# Altium project PCL_P1.PrjPcb
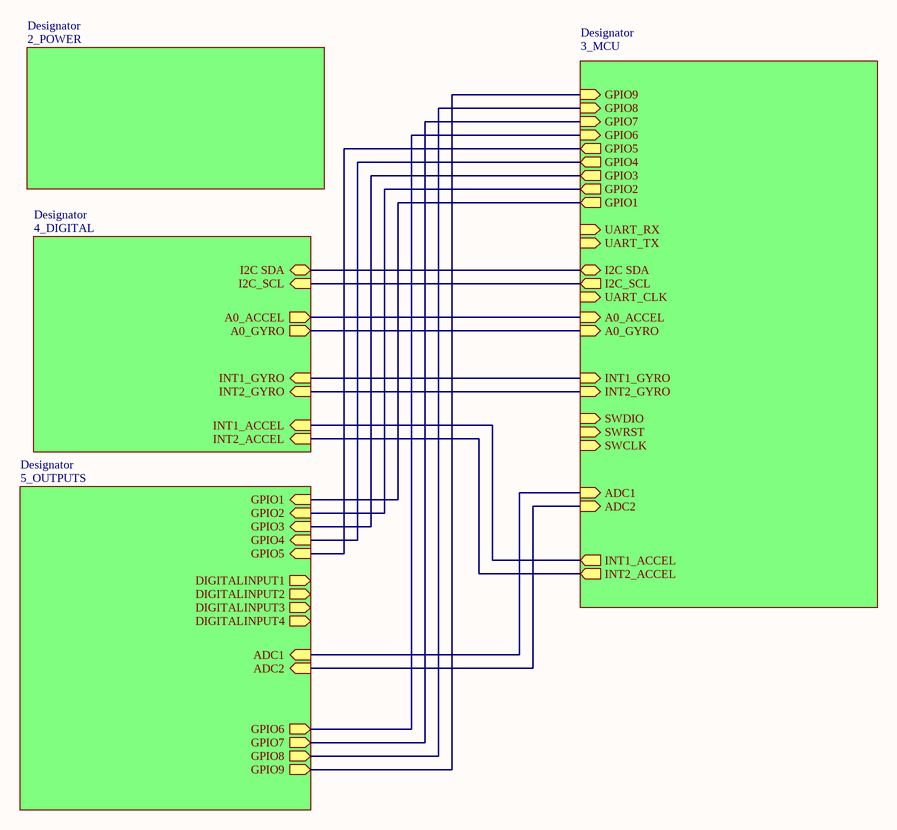
[diagram p0: 1_BLOCK.SchDoc]
5 sheets, 135 parts. Net scope: hierarchical (ports join the sheet entries above them; power ports are global).
Board file: PCB1.PcbDoc
Sheets:
  1_BLOCK.SchDoc
    Designator = 3_MCU.SchDoc
    Designator = 4_DIGITAL.SchDoc
    Designator = 5_OUTPUTS.SchDoc
    Designator = 2_POWER.SchDoc

## Sheet 1_BLOCK.SchDoc
size 420 x 297 mm; SheetNumber: 1; SheetTotal: 4

### Sub-sheets
Designator = 3_MCU: GPIO1 (out), GPIO2 (out), GPIO3 (out), GPIO4 (out), GPIO5 (out), GPIO6 (in), GPIO7 (in), GPIO8 (in), GPIO9 (in), SWDIO (in), I2C SDA (bidir), I2C_SCL (out), UART_CLK (in), A0_ACCEL (in), A0_GYRO (in), INT1_GYRO (in), INT2_GYRO (in), SWRST (in), UART_TX (in), UART_RX (in), ADC1 (in), ADC2 (in), SWCLK (in), INT1_ACCEL (out), INT2_ACCEL (out)
Designator = 4_DIGITAL: I2C_SCL (in), A0_ACCEL (out), A0_GYRO (out), INT1_GYRO (in), INT2_GYRO (in), I2C SDA (bidir), INT1_ACCEL (in), INT2_ACCEL (in)
Designator = 5_OUTPUTS: GPIO1 (in), GPIO2 (in), GPIO3 (in), GPIO4 (in), GPIO5 (in), GPIO6 (out), GPIO7 (out), GPIO8 (out), GPIO9 (out), DIGITALINPUT1 (out), DIGITALINPUT2 (out), DIGITALINPUT3 (out), DIGITALINPUT4 (out), ADC1 (in), ADC2 (in)
Designator = 2_POWER: no entries

### Nets
A0_ACCEL: sheet Designator/A0_ACCEL, sheet Designator/A0_ACCEL
A0_GYRO: sheet Designator/A0_GYRO, sheet Designator/A0_GYRO
ADC1: sheet Designator/ADC1, sheet Designator/ADC1
ADC2: sheet Designator/ADC2, sheet Designator/ADC2
GPIO1: sheet Designator/GPIO1, sheet Designator/GPIO1
GPIO2: sheet Designator/GPIO2, sheet Designator/GPIO2
GPIO3: sheet Designator/GPIO3, sheet Designator/GPIO3
GPIO4: sheet Designator/GPIO4, sheet Designator/GPIO4
GPIO5: sheet Designator/GPIO5, sheet Designator/GPIO5
GPIO6: sheet Designator/GPIO6, sheet Designator/GPIO6
GPIO7: sheet Designator/GPIO7, sheet Designator/GPIO7
GPIO8: sheet Designator/GPIO8, sheet Designator/GPIO8
GPIO9: sheet Designator/GPIO9, sheet Designator/GPIO9
I2C_SCL: sheet Designator/I2C_SCL, sheet Designator/I2C_SCL
I2C_SDA: sheet Designator/I2C SDA, sheet Designator/I2C SDA
INT1_ACCEL: sheet Designator/INT1_ACCEL, sheet Designator/INT1_ACCEL
INT1_GYRO: sheet Designator/INT1_GYRO, sheet Designator/INT1_GYRO
INT2_ACCEL: sheet Designator/INT2_ACCEL, sheet Designator/INT2_ACCEL
INT2_GYRO: sheet Designator/INT2_GYRO, sheet Designator/INT2_GYRO

### Notes on the sheet
- THIS DOCUMENT AND THE DATA DISCLOSED HEREIN OR
- HEREWITH IS THE PROPERTY OF ALTIUM LIMITED AND MAY
- DWG NO:
- REVISION
- REV:
- DESCRIPTION
- DATE
- APPROVED
- BE FREELY DISTRIBUTED IN WHOLE. NO RIGHTS ARE
- RESERVED OR EXPRESS OR IMPLIED WARANTEE GIVEN.
- ENG:
- APPROVALS
- PROJECT
- DSN:
- CHK:
- REFERENCE DOCUMENTS
- PROJECT REVISION:
- TITLE
- DOCUMENT REVISION:
- DESIGN ITEM:
- BOM:
- FAB DWG:
- PCB DWG:
- ASSY DWG:
- SCALE:
- A3
- SIZE
- CAGE CODE
- FILE NAME
- DWG NO.
- SHEET
- OF
- REV

## Sheet 3_MCU.SchDoc
size 420 x 297 mm; SheetNumber: 3; SheetTotal: 5
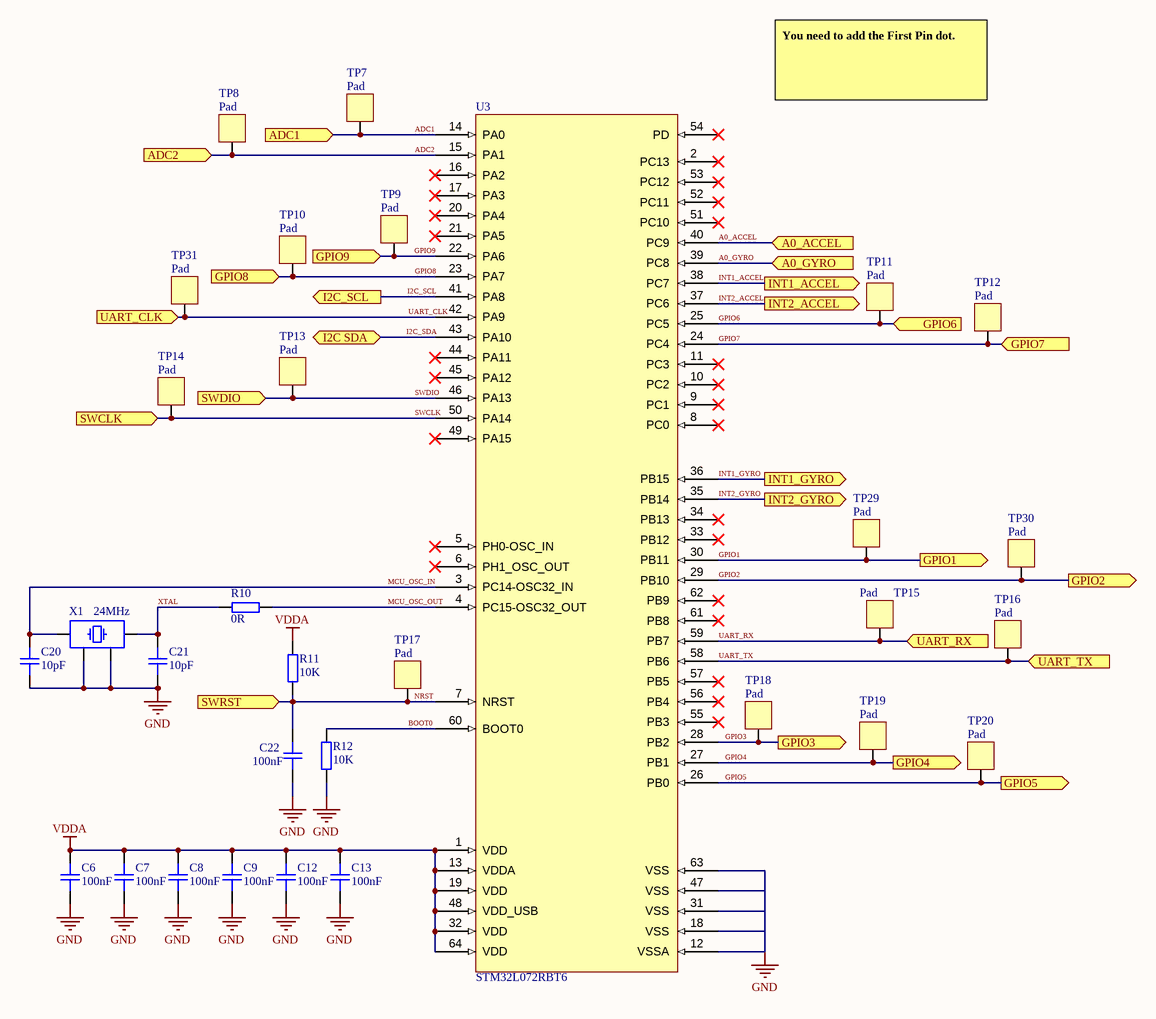
[diagram p1: 3_MCU.SchDoc]

### Parts
C6  100nF  [CAP_0603]
C7  100nF  [CAP_0603]
C8  100nF  [CAP_0603]
C9  100nF  [CAP_0603]
C12  100nF  [CAP_0603]
C13  100nF  [CAP_0603]
C20  10pF  [CAP_0402]
C21  10pF  [CAP_0402]
C22  100nF  [CAP_0603]
R10  0R  [RES_0603]
R11  10K  [RES_0603]
R12  10K  [RES_0603]
TP7  Pad  [PAD_SQ_2MM]  (no BOM)
TP8  Pad  [PAD_SQ_2MM]  (no BOM)
TP9  Pad  [PAD_SQ_2MM]  (no BOM)
TP10  Pad  [PAD_SQ_2MM]  (no BOM)
TP11  Pad  [PAD_SQ_2MM]  (no BOM)
TP12  Pad  [PAD_SQ_2MM]  (no BOM)
TP13  Pad  [PAD_SQ_2MM]  (no BOM)
TP14  Pad  [PAD_SQ_2MM]  (no BOM)
TP15  Pad  [PAD_SQ_2MM]  (no BOM)
TP16  Pad  [PAD_SQ_2MM]  (no BOM)
TP17  Pad  [PAD_SQ_2MM]  (no BOM)
TP18  Pad  [PAD_SQ_2MM]  (no BOM)
TP19  Pad  [PAD_SQ_2MM]  (no BOM)
TP20  Pad  [PAD_SQ_2MM]  (no BOM)
TP29  Pad  [PAD_SQ_2MM]  (no BOM)
TP30  Pad  [PAD_SQ_2MM]  (no BOM)
TP31  Pad  [PAD_SQ_2MM]  (no BOM)
U3  STM32L072RBT6  [LQFP64 - 64-pin]
X1  24MHz  [XTAL_2520]

### Ports
A0_ACCEL (in, see 1_BLOCK[3C], 4_DIGITAL[1C]), A0_GYRO (in, see 1_BLOCK[3C], 4_DIGITAL[1C]), ADC1 (in, see 1_BLOCK[3C], 5_OUTPUTS[1D]), ADC2 (in, see 1_BLOCK[3C], 5_OUTPUTS[2D]), GPIO1 (out, see 1_BLOCK[3B], 5_OUTPUTS[1B]), GPIO2 (out, see 1_BLOCK[3B], 5_OUTPUTS[1B]), GPIO3 (out, see 1_BLOCK[3B], 5_OUTPUTS[1B]), GPIO4 (out, see 1_BLOCK[3B], 5_OUTPUTS[2B]), GPIO5 (out, see 1_BLOCK[3B], 5_OUTPUTS[2B]), GPIO6 (in, see 1_BLOCK[3B], 5_OUTPUTS[2C]), GPIO7 (in, see 1_BLOCK[3B], 5_OUTPUTS[2C]), GPIO8 (in, see 1_BLOCK[3B], 5_OUTPUTS[2C]), GPIO9 (in, see 1_BLOCK[3B], 5_OUTPUTS[2C]), I2C SDA (bidir, see 1_BLOCK[3C], 4_DIGITAL[2C]), I2C_SCL (out, see 1_BLOCK[3C], 4_DIGITAL[2C]), INT1_ACCEL (out, see 1_BLOCK[3C], 4_DIGITAL[3C]), INT1_GYRO (out, see 1_BLOCK[3C], 4_DIGITAL[4C]), INT2_ACCEL (out, see 1_BLOCK[3C], 4_DIGITAL[0C], 4_DIGITAL[3C]), INT2_GYRO (out, see 1_BLOCK[3C], 4_DIGITAL[4C]), SWCLK (in, see 1_BLOCK[3C]), SWDIO (in, see 1_BLOCK[3C]), SWRST (in, see 1_BLOCK[3C]), UART_CLK (in, see 1_BLOCK[3C]), UART_RX (in, see 1_BLOCK[3C]), UART_TX (in, see 1_BLOCK[3C])

### Nets
GND: C6.1 C7.1 C8.1 C9.1 C12.1 C13.1 C20.1 C21.1 C22.1 R12.1 U3.12(VSSA) U3.18(VSS) U3.31(VSS) U3.47(VSS) U3.63(VSS) X1.2 X1.4
VDDA: C6.2 C7.2 C8.2 C9.2 C12.2 C13.2 R11.2 U3.1(VDD) U3.13(VDDA) U3.19(VDD) U3.32(VDD) U3.48(VDD_USB) U3.64(VDD)  [project net 3V]
A0_ACCEL: U3.40(PC9) ; port A0_ACCEL
A0_GYRO: U3.39(PC8) ; port A0_GYRO
ADC1: TP7.1 U3.14(PA0) ; port ADC1
ADC2: TP8.1 U3.15(PA1) ; port ADC2
BOOT0: R12.2 U3.60(BOOT0)
GPIO1: TP29.1 U3.30(PB11) ; port GPIO1
GPIO2: TP30.1 U3.29(PB10) ; port GPIO2
GPIO3: TP18.1 U3.28(PB2) ; port GPIO3
GPIO4: TP19.1 U3.27(PB1) ; port GPIO4
GPIO5: TP20.1 U3.26(PB0) ; port GPIO5
GPIO6: TP11.1 U3.25(PC5) ; port GPIO6
GPIO7: TP12.1 U3.24(PC4) ; port GPIO7
GPIO8: TP10.1 U3.23(PA7) ; port GPIO8
GPIO9: TP9.1 U3.22(PA6) ; port GPIO9
I2C_SCL: U3.41(PA8) ; port I2C_SCL
I2C_SDA: U3.43(PA10) ; port I2C SDA
INT1_ACCEL: U3.38(PC7) ; port INT1_ACCEL
INT1_GYRO: U3.36(PB15) ; port INT1_GYRO
INT2_ACCEL: U3.37(PC6) ; port INT2_ACCEL
INT2_GYRO: U3.35(PB14) ; port INT2_GYRO
MCU_OSC_IN: C20.2 U3.3(PC14-OSC32_IN) X1.1
MCU_OSC_OUT: R10.2 U3.4(PC15-OSC32_OUT)
NRST: C22.2 R11.1 TP17.1 U3.7(NRST) ; port SWRST
SWCLK: TP14.1 U3.50(PA14) ; port SWCLK
SWDIO: TP13.1 U3.46(PA13) ; port SWDIO
UART_CLK: TP31.1 U3.42(PA9) ; port UART_CLK
UART_RX: TP15.1 U3.59(PB7) ; port UART_RX
UART_TX: TP16.1 U3.58(PB6) ; port UART_TX
XTAL: C21.2 R10.1 X1.3

Not connected (* = marked no-connect by the designer): U3 2(PC13)* 5(PH0-OSC_IN)* 6(PH1_OSC_OUT)* 8(PC0)* 9(PC1)* 10(PC2)* 11(PC3)* 16(PA2)* 17(PA3)* 20(PA4)* 21(PA5)* 33(PB12)* 34(PB13)* 44(PA11)* 45(PA12)* 49(PA15)* 51(PC10)* 52(PC11)* 53(PC12)* 54(PD)* 55(PB3)* 56(PB4)* 57(PB5)* 61(PB8)* 62(PB9)*

### Notes on the sheet
- You need to add the First Pin dot.
- THIS DOCUMENT AND THE DATA DISCLOSED HEREIN OR
- HEREWITH IS THE PROPERTY OF ALTIUM LIMITED AND MAY
- DWG NO:
- REVISION
- REV:
- DESCRIPTION
- DATE
- APPROVED
- BE FREELY DISTRIBUTED IN WHOLE. NO RIGHTS ARE
- RESERVED OR EXPRESS OR IMPLIED WARANTEE GIVEN.
- ENG:
- APPROVALS
- PROJECT
- DSN:
- CHK:
- REFERENCE DOCUMENTS
- PROJECT REVISION:
- TITLE
- DOCUMENT REVISION:
- DESIGN ITEM:
- BOM:
- FAB DWG:
- PCB DWG:
- ASSY DWG:
- SCALE:
- A3
- SIZE
- CAGE CODE
- FILE NAME
- DWG NO.
- SHEET
- OF
- REV

### Library data of the parts
C6-C9 C12 C13 C22 = CAP_0603_16V: Capacitor SMD 0603 16V
C20 C21 = CAP_0402_16V: Capacitor SMD 0402 16V
R10-R12 = RES_0603: Resistor SMD 0603; Manufacturer: *; Manufacturer Part Number: *; Distributor Link: *
TP7-TP20 TP29-TP31 = PAD_SQ_2MM: Test Point Square 2mm
U3 = STM32L072RBT6: 128KB 1.8V~3.6V ARM-MSeries 20KB 32MHz FLASH 51 LQFP-64(10x10) Microcontroller Units (MCUs/MPUs/SOCs) ROHS
X1 = XTAL_2520: Crystal SMD 2520; Distributor Link: *

## Sheet 4_DIGITAL.SchDoc
size 420 x 297 mm; SheetNumber: 4; SheetTotal: 5
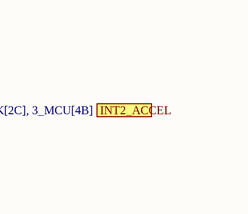
[diagram p2: 4_DIGITAL.SchDoc, left]
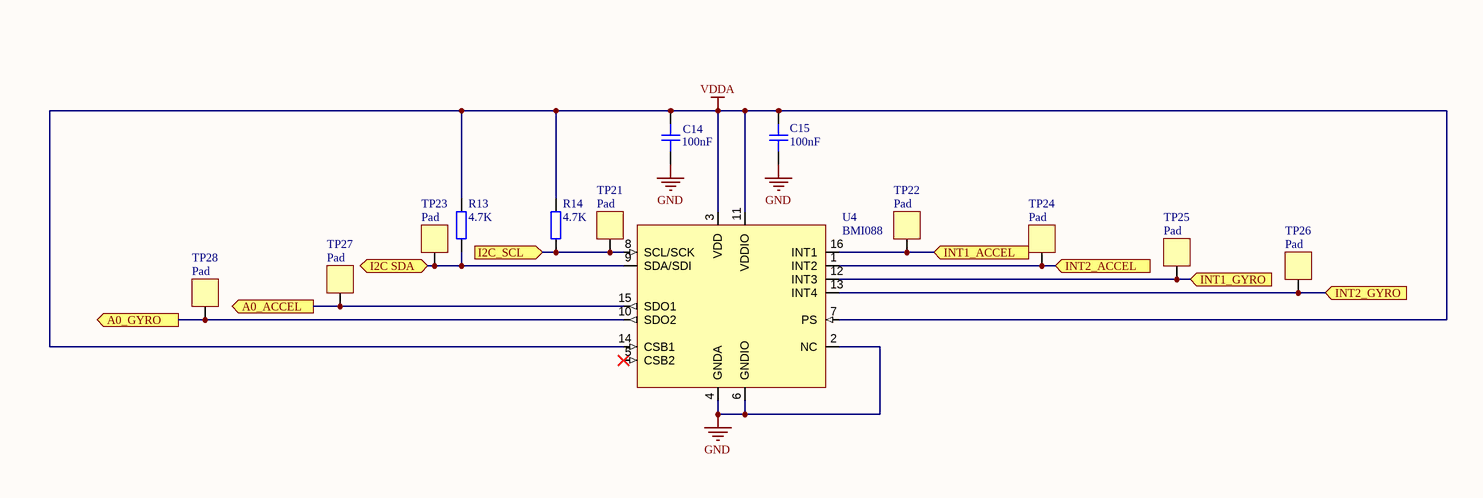
[diagram p3: 4_DIGITAL.SchDoc, right]

### Parts
C14  100nF  [CAP_0603]
C15  100nF  [CAP_0603]
R13  4.7K  [RES_0603]
R14  4.7K  [RES_0603]
TP21  Pad  [PAD_SQ_2MM]  (no BOM)
TP22  Pad  [PAD_SQ_2MM]  (no BOM)
TP23  Pad  [PAD_SQ_2MM]  (no BOM)
TP24  Pad  [PAD_SQ_2MM]  (no BOM)
TP25  Pad  [PAD_SQ_2MM]  (no BOM)
TP26  Pad  [PAD_SQ_2MM]  (no BOM)
TP27  Pad  [PAD_SQ_2MM]  (no BOM)
TP28  Pad  [PAD_SQ_2MM]  (no BOM)
U4  BMI088  [BMI088]

### Ports
A0_ACCEL (out, see 1_BLOCK[2C], 3_MCU[4B]), A0_GYRO (out, see 1_BLOCK[2C], 3_MCU[4B]), I2C SDA (bidir, see 1_BLOCK[2C], 3_MCU[3B]), I2C_SCL (in, see 1_BLOCK[2C], 3_MCU[3B]), INT1_ACCEL (in, see 1_BLOCK[2C], 3_MCU[4B]), INT1_GYRO (in, see 1_BLOCK[2C], 3_MCU[4B]), INT2_ACCEL (in, see 1_BLOCK[2C], 3_MCU[4B]), INT2_ACCEL (see 1_BLOCK[2C], 3_MCU[4B]), INT2_GYRO (in, see 1_BLOCK[2C], 3_MCU[4B])

### Nets
GND: C14.1 C15.1 U4.2(NC) U4.4(GNDA) U4.6(GNDIO)
VDDA: C14.2 C15.2 R13.2 R14.2 U4.3(VDD) U4.7(PS) U4.11(VDDIO) U4.14(CSB1)  [project net 3V]
A0_ACCEL: TP27.1 U4.15(SDO1) ; port A0_ACCEL
A0_GYRO: TP28.1 U4.10(SDO2) ; port A0_GYRO
I2C_SCL: R14.1 TP21.1 U4.8(SCL/SCK) ; port I2C_SCL
I2C_SDA: R13.1 TP23.1 U4.9(SDA/SDI) ; port I2C SDA
INT1_ACCEL: TP22.1 U4.16(INT1) ; port INT1_ACCEL
INT1_GYRO: TP25.1 U4.12(INT3) ; port INT1_GYRO
INT2_ACCEL: TP24.1 U4.1(INT2) ; port INT2_ACCEL
INT2_GYRO: TP26.1 U4.13(INT4) ; port INT2_GYRO

Not connected (* = marked no-connect by the designer): U4 5(CSB2)*

### Notes on the sheet
- THIS DOCUMENT AND THE DATA DISCLOSED HEREIN OR
- HEREWITH IS THE PROPERTY OF ALTIUM LIMITED AND MAY
- DWG NO:
- REVISION
- REV:
- DESCRIPTION
- DATE
- APPROVED
- BE FREELY DISTRIBUTED IN WHOLE. NO RIGHTS ARE
- RESERVED OR EXPRESS OR IMPLIED WARANTEE GIVEN.
- ENG:
- APPROVALS
- PROJECT
- DSN:
- CHK:
- REFERENCE DOCUMENTS
- PROJECT REVISION:
- TITLE
- DOCUMENT REVISION:
- DESIGN ITEM:
- BOM:
- FAB DWG:
- PCB DWG:
- ASSY DWG:
- SCALE:
- A3
- SIZE
- CAGE CODE
- FILE NAME
- DWG NO.
- SHEET
- OF
- REV

### Library data of the parts
C14 C15 = CAP_0603_16V: Capacitor SMD 0603 16V
R13 R14 = RES_0603: Resistor SMD 0603; Manufacturer: *; Manufacturer Part Number: *; Distributor Link: *
TP21-TP28 = PAD_SQ_2MM: Test Point Square 2mm
U4 = BMI088: Inertial Measurement Unit IMU 6-Axis LGA; Manufacturer: Bosch; Manufacturer Part Number: BMI088

## Sheet 5_OUTPUTS.SchDoc
size 420 x 297 mm; SheetNumber: 5; SheetTotal: 5
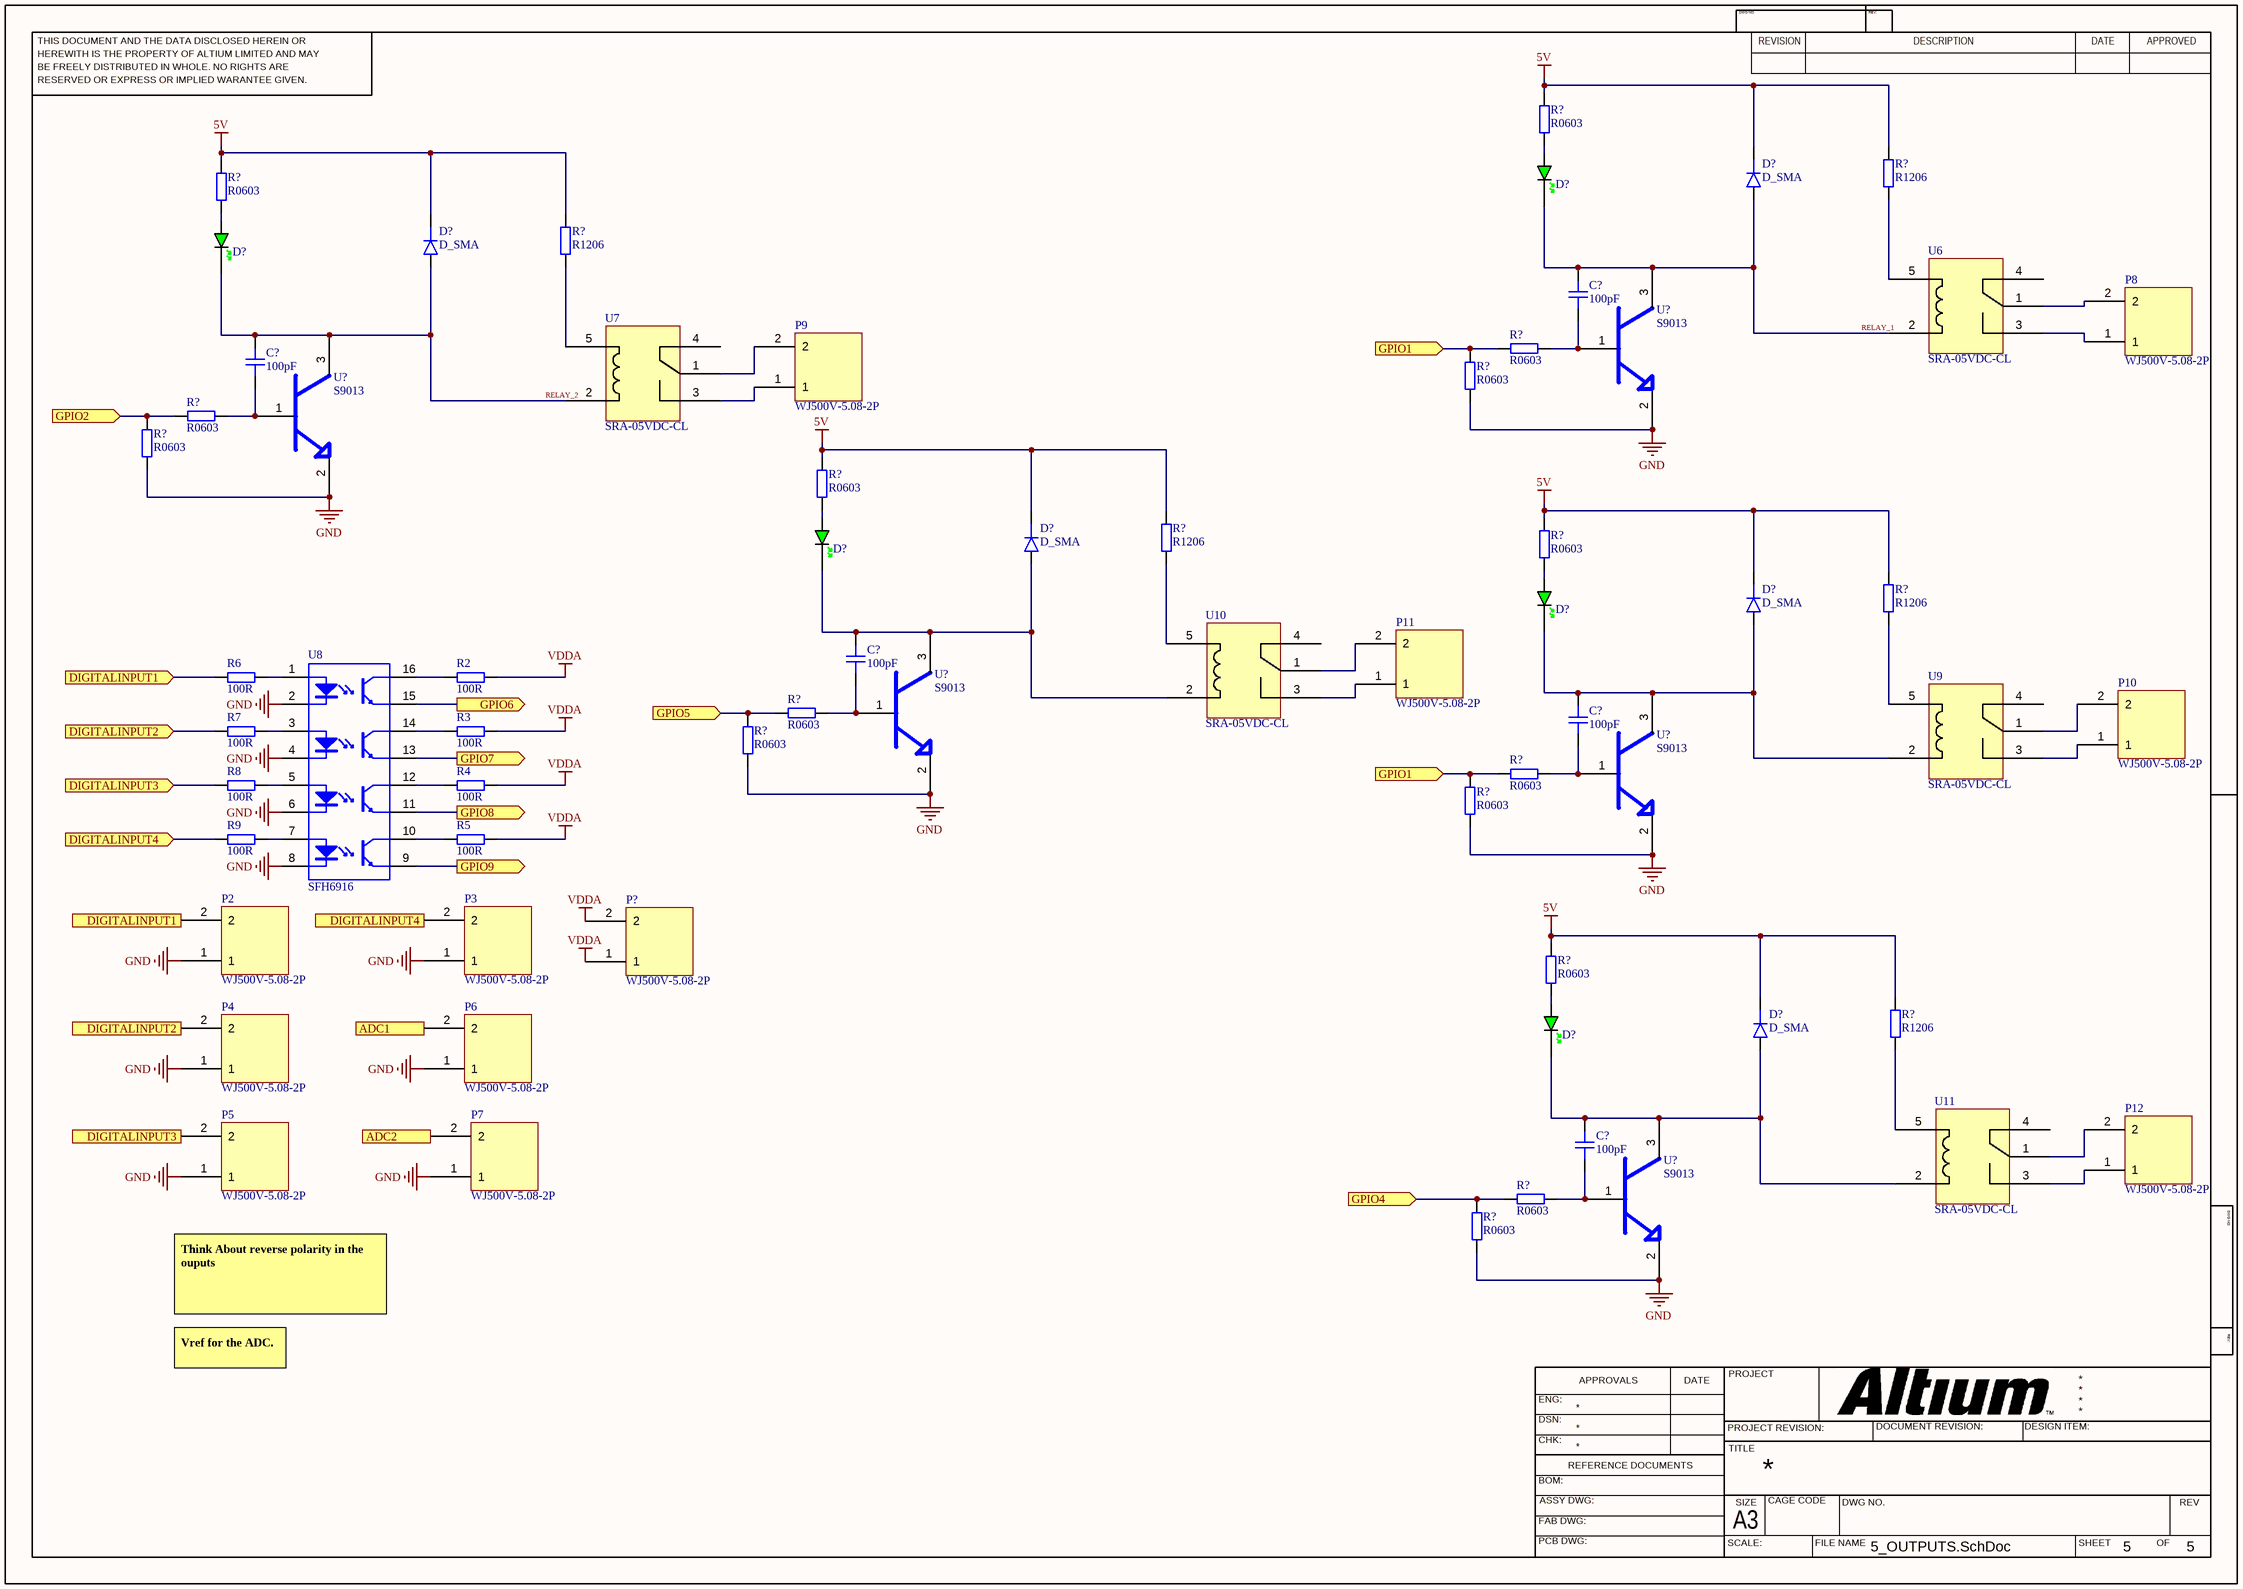
[diagram p4: 5_OUTPUTS.SchDoc]

### Parts
(Parts that share a designator on the sheet are numbered #1, #2 ... from top to bottom, then left to right.)
C?#1  100pF  [CAP_0603]
C?#2  100pF  [CAP_0603]
C?#3  100pF  [CAP_0603]
C?#4  100pF  [CAP_0603]
C?#5  100pF  [CAP_0603]
D?#1  D_SMA  [DO-214AC-2 (SMA)]
D?#2  GREEN  [LED_0603_GREEN]  (value not drawn)
D?#3  D_SMA  [DO-214AC-2 (SMA)]
D?#4  GREEN  [LED_0603_GREEN]  (value not drawn)
D?#5  D_SMA  [DO-214AC-2 (SMA)]
D?#6  GREEN  [LED_0603_GREEN]  (value not drawn)
D?#7  D_SMA  [DO-214AC-2 (SMA)]
D?#8  GREEN  [LED_0603_GREEN]  (value not drawn)
D?#9  D_SMA  [DO-214AC-2 (SMA)]
D?#10  GREEN  [LED_0603_GREEN]  (value not drawn)
P2  WJ500V-5.08-2P  [WJ500V-5.08-2P]
P3  WJ500V-5.08-2P  [WJ500V-5.08-2P]
P4  WJ500V-5.08-2P  [WJ500V-5.08-2P]
P5  WJ500V-5.08-2P  [WJ500V-5.08-2P]
P6  WJ500V-5.08-2P  [WJ500V-5.08-2P]
P7  WJ500V-5.08-2P  [WJ500V-5.08-2P]
P8  WJ500V-5.08-2P  [WJ500V-5.08-2P]
P9  WJ500V-5.08-2P  [WJ500V-5.08-2P]
P10  WJ500V-5.08-2P  [WJ500V-5.08-2P]
P11  WJ500V-5.08-2P  [WJ500V-5.08-2P]
P12  WJ500V-5.08-2P  [WJ500V-5.08-2P]
P?  WJ500V-5.08-2P  [WJ500V-5.08-2P]
R2  100R  [RES_0603]
R3  100R  [RES_0603]
R4  100R  [RES_0603]
R5  100R  [RES_0603]
R6  100R  [RES_0603]
R7  100R  [RES_0603]
R8  100R  [RES_0603]
R9  100R  [RES_0603]
R?#1  R0603  [RES_0603]
R?#2  R1206  [RES_1206]
R?#3  R0603  [RES_0603]
R?#4  R1206  [RES_1206]
R?#5  R0603  [RES_0603]
R?#6  R0603  [RES_0603]
R?#7  R0603  [RES_0603]
R?#8  R0603  [RES_0603]
R?#9  R0603  [RES_0603]
R?#10  R1206  [RES_1206]
R?#11  R0603  [RES_0603]
R?#12  R1206  [RES_1206]
R?#13  R0603  [RES_0603]
R?#14  R0603  [RES_0603]
R?#15  R0603  [RES_0603]
R?#16  R0603  [RES_0603]
R?#17  R0603  [RES_0603]
R?#18  R1206  [RES_1206]
R?#19  R0603  [RES_0603]
R?#20  R0603  [RES_0603]
U6  SRA-05VDC-CL  [SRA-05VDC-CL]
U7  SRA-05VDC-CL  [SRA-05VDC-CL]
U8  SFH6916  [VISH-SOP-16_V]
U9  SRA-05VDC-CL  [SRA-05VDC-CL]
U10  SRA-05VDC-CL  [SRA-05VDC-CL]
U11  SRA-05VDC-CL  [SRA-05VDC-CL]
U?#1  S9013  [SOT-23-3]
U?#2  S9013  [SOT-23-3]
U?#3  S9013  [SOT-23-3]
U?#4  S9013  [SOT-23-3]
U?#5  S9013  [SOT-23-3]

### Ports
ADC1 (in, see 1_BLOCK[2D], 3_MCU[3A]), ADC2 (in, see 1_BLOCK[2D], 3_MCU[2A]), DIGITALINPUT1 (in, see 1_BLOCK[2C]), DIGITALINPUT1 (out, see 1_BLOCK[2C]), DIGITALINPUT2 (in, see 1_BLOCK[2C]), DIGITALINPUT2 (out, see 1_BLOCK[2C]), DIGITALINPUT3 (in, see 1_BLOCK[2C]), DIGITALINPUT3 (out, see 1_BLOCK[2C]), DIGITALINPUT4 (in, see 1_BLOCK[2D]), DIGITALINPUT4 (out, see 1_BLOCK[2D]), GPIO1 (in, see 1_BLOCK[2C], 3_MCU[4B]), GPIO2 (in, see 1_BLOCK[2C], 3_MCU[5B]), GPIO4 (in, see 1_BLOCK[2C], 3_MCU[4C]), GPIO5 (in, see 1_BLOCK[2C], 3_MCU[5C]), GPIO6 (out, see 1_BLOCK[2D], 3_MCU[4B]), GPIO7 (out, see 1_BLOCK[2D], 3_MCU[5B]), GPIO8 (out, see 1_BLOCK[2D], 3_MCU[2B]), GPIO9 (out, see 1_BLOCK[2D], 3_MCU[3B])

### Nets
5V: D?#1.K D?#3.K D?#5.K D?#7.K D?#9.K R?#1.2 R?#2.2 R?#3.2 R?#4.2 R?#9.2 R?#10.2 R?#11.2 R?#12.2 R?#17.2 R?#18.2
GND: P2.1 P3.1 P4.1 P5.1 P6.1 P7.1 R?#6.1 R?#8.1 R?#14.1 R?#16.1 R?#20.1 U8.2(C) U8.4(C) U8.6(C) U8.8(C) U?#1.2 U?#2.2 U?#3.2 U?#4.2 U?#5.2
VDDA: P?.1 P?.2 R2.2 R3.2 R4.2 R5.2  [project net 3V]
ADC1: P6.2 ; port ADC1
ADC2: P7.2 ; port ADC2
GPIO1: R?#5.1 R?#6.2 R?#15.1 R?#16.2 ; port GPIO1
GPIO2: R?#7.1 R?#8.2 ; port GPIO2
GPIO4: R?#19.1 R?#20.2 ; port GPIO4
GPIO5: R?#13.1 R?#14.2 ; port GPIO5
GPIO6: U8.15(E) ; port GPIO6
GPIO7: U8.13(E) ; port GPIO7
GPIO8: U8.11(E) ; port GPIO8
GPIO9: U8.9(E) ; port GPIO9
RELAY_1: C?#1.1 D?#1.A D?#2.K U6.2 U?#1.3
RELAY_2: C?#2.1 D?#3.A D?#4.K U7.2 U?#2.3
NetC?#1_2: C?#1.2 R?#5.2 U?#1.1
NetC?#2_2: C?#2.2 R?#7.2 U?#2.1
NetC?#3_1: C?#3.1 D?#5.A D?#6.K U10.2 U?#3.3
NetC?#3_2: C?#3.2 R?#13.2 U?#3.1
NetC?#4_1: C?#4.1 D?#7.A D?#8.K U9.2 U?#4.3
NetC?#4_2: C?#4.2 R?#15.2 U?#4.1
NetC?#5_1: C?#5.1 D?#9.A D?#10.K U11.2 U?#5.3
NetC?#5_2: C?#5.2 R?#19.2 U?#5.1
NetD?#2_A: D?#2.A R?#1.1
NetD?#4_A: D?#4.A R?#3.1
NetD?#6_A: D?#6.A R?#9.1
NetD?#8_A: D?#8.A R?#11.1
NetD?#10_A: D?#10.A R?#17.1
NetP2_2: P2.2 R6.1 ; port DIGITALINPUT1
NetP3_2: P3.2 R9.1 ; port DIGITALINPUT4
NetP4_2: P4.2 R7.1 ; port DIGITALINPUT2
NetP5_2: P5.2 R8.1 ; port DIGITALINPUT3
NetP8_1: P8.1 U6.3
NetP8_2: P8.2 U6.1
NetP9_1: P9.1 U7.3
NetP9_2: P9.2 U7.1
NetP10_1: P10.1 U9.3
NetP10_2: P10.2 U9.1
NetP11_1: P11.1 U10.3
NetP11_2: P11.2 U10.1
NetP12_1: P12.1 U11.3
NetP12_2: P12.2 U11.1
NetR2_1: R2.1 U8.16(C)
NetR3_1: R3.1 U8.14(C)
NetR4_1: R4.1 U8.12(C)
NetR5_1: R5.1 U8.10(C)
NetR6_2: R6.2 U8.1(A)
NetR7_2: R7.2 U8.3(A)
NetR8_2: R8.2 U8.5(A)
NetR9_2: R9.2 U8.7(A)
NetR?#2_1: R?#2.1 U6.5
NetR?#4_1: R?#4.1 U7.5
NetR?#10_1: R?#10.1 U10.5
NetR?#12_1: R?#12.1 U9.5
NetR?#18_1: R?#18.1 U11.5

Not connected (* = marked no-connect by the designer): U6 4; U7 4; U9 4; U10 4; U11 4

### Notes on the sheet
- Think About reverse polarity in the ouputs
- Vref for the ADC.
- THIS DOCUMENT AND THE DATA DISCLOSED HEREIN OR
- HEREWITH IS THE PROPERTY OF ALTIUM LIMITED AND MAY
- DWG NO:
- REVISION
- REV:
- DESCRIPTION
- DATE
- APPROVED
- BE FREELY DISTRIBUTED IN WHOLE. NO RIGHTS ARE
- RESERVED OR EXPRESS OR IMPLIED WARANTEE GIVEN.
- ENG:
- APPROVALS
- PROJECT
- DSN:
- CHK:
- REFERENCE DOCUMENTS
- PROJECT REVISION:
- TITLE
- DOCUMENT REVISION:
- DESIGN ITEM:
- BOM:
- FAB DWG:
- PCB DWG:
- ASSY DWG:
- SCALE:
- A3
- SIZE
- CAGE CODE
- FILE NAME
- DWG NO.
- SHEET
- OF
- REV

### Library data of the parts
C?#1-C?#5 = CAP_0603_16V: Capacitor SMD 0603 16V
D?#1 D?#3 D?#5 D?#7 D?#9 = D_SMA: Diode SMD SMA (DO-214AA)
D?#2 D?#4 D?#6 D?#8 D?#10 = LED_0603_GREEN: LED 0603 GREEN SMD
P2-P12 P? = WJ500V-5.08-2P: 1x2P 18A -40℃~+105℃ 250V Green 14~30 Straight 5.08mm 2.5 1 2 Plugin,P=5.08mm Screw terminal ROHS
R2-R9 R?#1 R?#3 R?#5-R?#9 R?#11 R?#13-R?#17 R?#19 R?#20 = RES_0603: Resistor SMD 0603; Manufacturer: *; Manufacturer Part Number: *; Distributor Link: *
R?#2 R?#4 R?#10 R?#12 R?#18 = RES_1206: Resistor SMD 1206; Manufacturer: *; Manufacturer Part Number: *; Distributor Link: *
U6 U7 U9-U11 = SRA-05VDC-CL: 5V 10A 20A@14VAC SPDT (1 Form C) 5 Plugin,12.4x16mm Power Relays ROHS
U8 = CMP-2000-07047-1: Optocoupler, Phototransistor Output, Quad Channel, 50 mA, 1.15 V, -55 to 100 degC, 16-Pin SOP, Pb-Free, Tube; Manufacturer: Vishay; Collector Current (DC): 0.1A; Rad Hardened: No; Input Type: DC; Power Dissipation: 0.15W; Current Transfer Ratio: 300%; Reverse Breakdown Voltage: 6V; Collector-Emitter Voltage: 70V; DELETED: Compliant; Forward Current: 50mA; Number of  Elements: 4; Forward Voltage: 1.4V; Collector-Emitter Saturation Voltage: 0.4V; Isolation Voltage: 3750V; Package Reference: SOP-16; Operating Temperature Classification: Industrial; Manufacturer URL: http://www.vishay.com/; Mounting Technology: SurfaceMount; Operating Temp Range: -55Cto100C; Package Type: SOP; Collector Current (DC) (Max): 0.1A; Output Type: DC; Datasheet URL: https://datasheet.ciiva.com/26913/sfh6916-26913222.pdf; Output Device: Transistor; Datasheet Version: Rev. 2.0, 12/2011; Package Description: 16-Pin Small Outline Package Integrated Circuit, Body 4.575 x 10.77 mm, Pitch 1.27 mm; Mounting: SurfaceMount; Pin Count: 16
U?#1-U?#5 = S9013: SOT-23 Bipolar Transistors - BJT ROHS

## Sheet 2_POWER.SchDoc: PLC P1
size 420 x 297 mm; CompanyName: Pytenax; DrawnBy: Otavio Luz; DocumentNumber: 2; Revision: 2; SheetNumber: 2; SheetTotal: 5
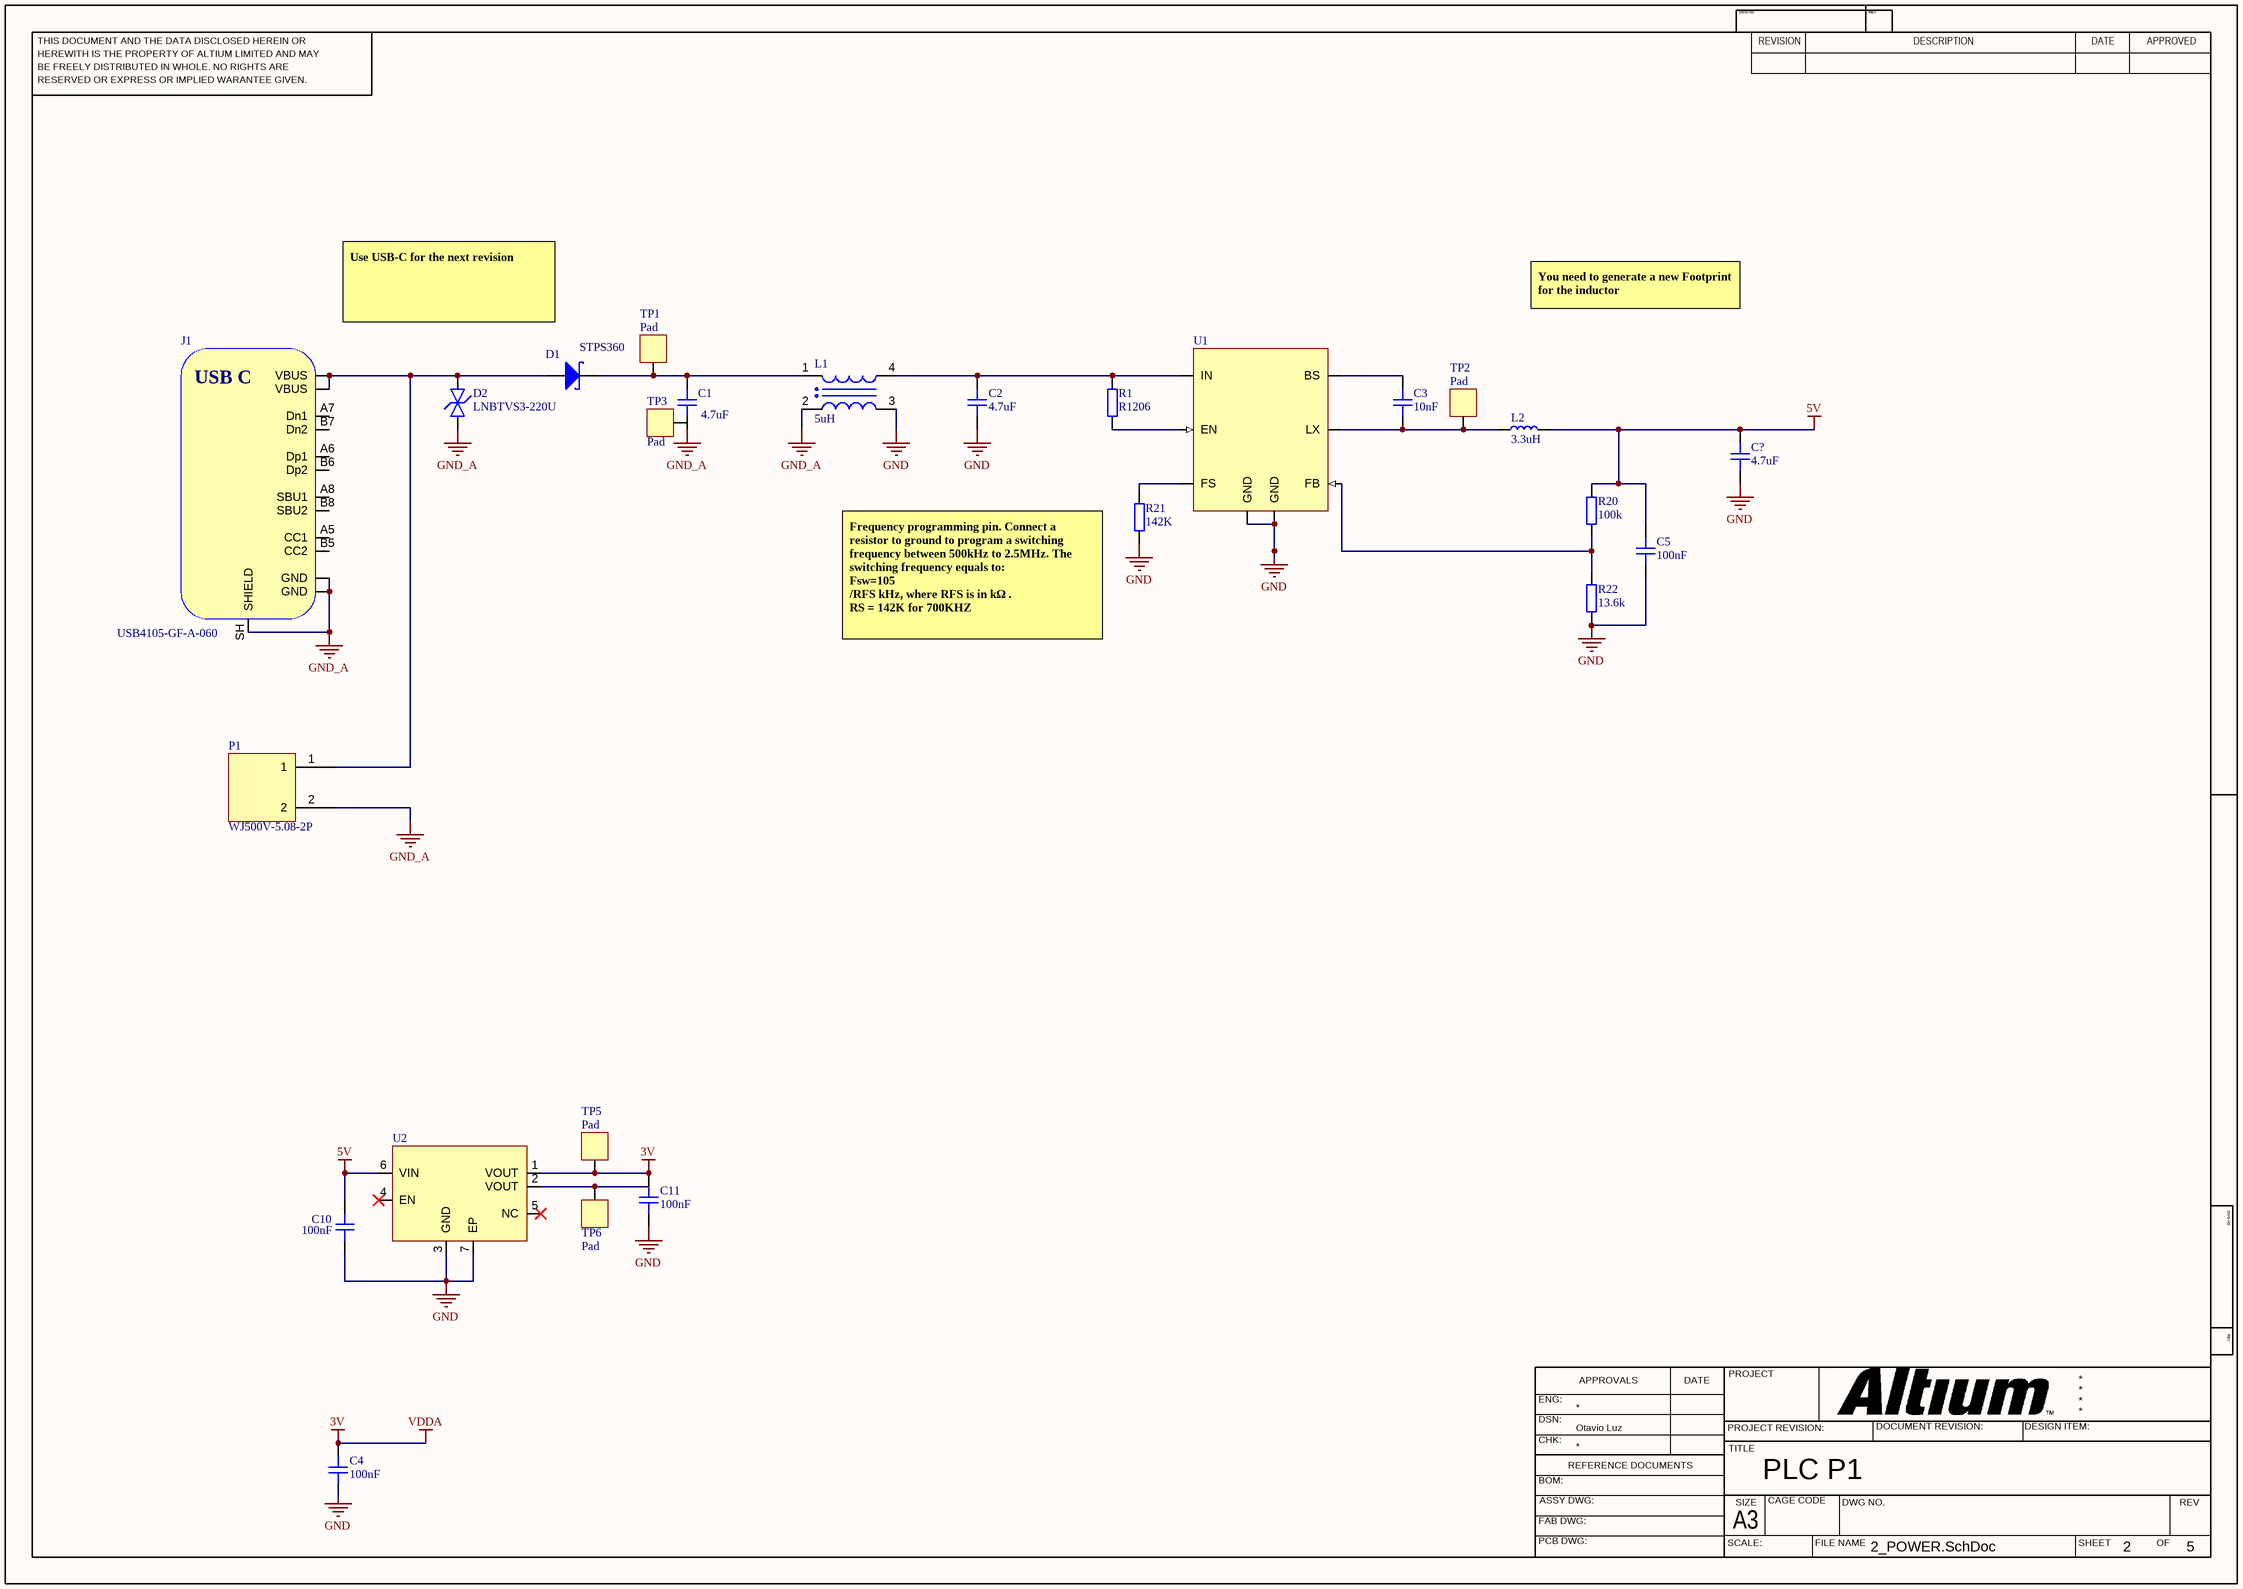
[diagram p5: 2_POWER.SchDoc]

### Parts
(Parts that share a designator on the sheet are numbered #1, #2 ... from top to bottom, then left to right.)
C1  4.7uF  [CAP_0603]
C2  4.7uF  [CAP_0603]
C3  10nF  [CAP_0603]
C4  100nF  [CAP_0603]
C5  100nF  [CAP_0603]
C10  100nF  [CAP_0603]
C11  100nF  [CAP_0603]
C?#6  4.7uF  [CAP_0603]
D1  value STPS360  [SOD-128]  (hidden comment: STPS360-Y)
D2  LNBTVS3-220U  [SMC-DO-214AB]
J1  USB4105-GF-A-060  [USB4105-GF-A-060]
L1  value 5uH  [WE-SL5 HC]
L2  3.3uH  [ASPI-0630HI-6R8M-T15]
P1  WJ500V-5.08-2P  [WJ500V-5.08-2P]
R1  R1206  [RES_1206]
R20  100k  [RES_0603]
R21  142K  [RES_0603]
R22  13.6k  [RES_0603]
TP1  Pad  [PAD_SQ_2MM]  (no BOM)
TP2  Pad  [PAD_SQ_2MM]  (no BOM)
TP3  Pad  [PAD_SQ_2MM]  (no BOM)
TP5  Pad  [PAD_SQ_2MM]  (no BOM)
TP6  Pad  [PAD_SQ_2MM]  (no BOM)
U1  SY8303AIC  [TSOT23-8]  (value not drawn)
U2  MIC5528-3.3YMT-TR  [TDFN-6]  (value not drawn)

### Nets
3V: C4.2 C11.2 TP5.1 U2.1(VOUT)  [also labelled VDDA]
5V: C5.2 C10.2 C?#6.2 L2.2 R20.2 U2.6(VIN)
GND: C2.1 C4.1 C5.1 C10.1 C11.1 C?#6.1 L1.3 R21.1 R22.1 U1.3(GND) U1.4(GND) U2.3(GND) U2.7(EP)
GND_A: C1.1 D2.A J1.A1B12(GND) J1.B1A12(GND) J1.SH(SHIELD) L1.2 P1.2
NetC1_2: C1.2 D1.1(K) L1.1 TP1.1
NetC2_2: C2.2 L1.4 R1.2 U1.5(IN)
NetC3_1: C3.1 L2.1 TP2.1 U1.6(LX)
NetC3_2: C3.2 U1.7(BS)
NetD1_2: D1.2(A) D2.K J1.A4B9(VBUS) J1.B4A9(VBUS) P1.1
NetR1_1: R1.1 U1.8(EN)
NetR20_1: R20.1 R22.2 U1.1(FB)
NetR21_2: R21.2 U1.2(FS)
NetTP6_1: TP6.1 U2.2(VOUT)

Not connected (* = marked no-connect by the designer): J1 A5(CC1) A6(Dp1) A7(Dn1) A8(SBU1) B5(CC2) B6(Dp2) B7(Dn2) B8(SBU2); TP3 1; U2 4(EN)* 5(NC)*

### Notes on the sheet
- Use USB-C for the next revision
- You need to generate a new Footprint for the inductor
- (near R21) Frequency programming pin. Connect a resistor to ground to program a switching
  frequency between 500kHz to 2.5MHz. The switching frequency equals to:
  Fsw=105
  /RFS kHz, where RFS is in kΩ .
  RS = 142K for 700KHZ
- THIS DOCUMENT AND THE DATA DISCLOSED HEREIN OR
- HEREWITH IS THE PROPERTY OF ALTIUM LIMITED AND MAY
- DWG NO:
- REVISION
- REV:
- DESCRIPTION
- DATE
- APPROVED
- BE FREELY DISTRIBUTED IN WHOLE. NO RIGHTS ARE
- RESERVED OR EXPRESS OR IMPLIED WARANTEE GIVEN.
- ENG:
- APPROVALS
- PROJECT
- DSN:
- CHK:
- REFERENCE DOCUMENTS
- PROJECT REVISION:
- TITLE
- DOCUMENT REVISION:
- DESIGN ITEM:
- BOM:
- FAB DWG:
- PCB DWG:
- ASSY DWG:
- SCALE:
- A3
- SIZE
- CAGE CODE
- FILE NAME
- DWG NO.
- SHEET
- OF
- REV
- (in symbol USB4105-GF-A-060) USB C

### Library data of the parts
C1-C3 C5 C?#6 = CAP_0603_25V: Capacitor SMD 0603 25V
C4 C10 C11 = CAP_0603_16V: Capacitor SMD 0603 16V
D1 = CMP-01-D000008-4: Schottky 60V 3A Vf=0.610V SOD-128 -40°C +175°C; Internal Part Number: 01D008; Manufacturer Part Number: STPS360AFY; Manufacturer: STMicroelectronics; Max Temperature: 175°C; Voltage - Forward: 610mV; Current - Reverse Leakage: 150µA @ 60V; Mounting Technology: Surface Mount; RoHS Compliant: YES; Voltage - DC Reverse: 60V; Current - Average Rectified: 3A; Pins: 2; Package/Case: SOD-128; Min Temperature: -40°C; Ratings: AEC-Q101
D2 = D_TVS_BI_SMC: Diode TVS / ESD Bidirectional SMC (DO-214AB); Manufacturer: *; Manufacturer Part Number: *; Distributor Link: *
J1 = USB4105-GF-A-060: USB Connector Type C SMT 12 Pin; Manufacturer: GCT; Manufacturer Part Number: USB4105-GF-A-060
L1 = CMP-01-CMC000005-2: 5uH 5A 5.5mΩ 80V -40°C +125°C; Manufacturer: Wurth Elektronik; Internal Part Number: 01L003; Manufacturer Part Number: 744273501; Impedance @ Frequency: 500 Ohms @ 130MHz; Shielding: Unshielded; Max Temperature: 125°C; Voltage Rating: 80V; Min Temperature: -40°C; Current Rating (Max): 5A; DC Resistance (DCR) (Max): 5.5mΩ; Pins: 4; Package/Case: WE-SL5 HC; Mounting Technology: SMT; RoHS Compliant: YES; Size / Dimension: 9.50mm x 8.30mm; Inductor Type: Common Mode Choke; Height (Max): 5.3mm
L2 = ASPI-0630HI-6R8M-T15: 6.5A 3.3uH ±20% 23mΩ SMD,6.6x7.2mm Inductors (SMD) ROHS; Manufacturer: SHOU HAN; Manufacturer Part Number: CYA0630-3.3UH
P1 = WJ500V-5.08-2P: as P2 on sheet 5_OUTPUTS
R1 = RES_1206: Resistor SMD 1206; Manufacturer: *; Manufacturer Part Number: *; Distributor Link: *
R20-R22 = RES_0603: Resistor SMD 0603; Manufacturer: *; Manufacturer Part Number: *; Distributor Link: *
TP1-TP3 TP5 TP6 = PAD_SQ_2MM: Test Point Square 2mm
U1 = SY8303AIC: High Efficiency Fast Response, 3A, 40V Input Synchronous Step Down Regulator; Manufacturer: Silergy; Manufacturer Part Number: SY8303AIC; Distributor Link: https://www.lcsc.com/product-detail/DC-DC-Converters_Silergy-Corp-SY8303AIC_C97054.html; LCSC: C97054
U2 = MIC5528-3.3YMT-TR: LDO Regulator 3V3 500mA 2.5V<Vin<5.5V; Manufacturer: Microchip; Manufacturer Part Number: MIC5528-3.3YMT-TR

## Nets that join several sheets
3V: 3_MCU (13 pins), 4_DIGITAL (8 pins), 5_OUTPUTS (6 pins), 2_POWER (C4.2 C11.2 TP5.1 U2.1)
5V: 5_OUTPUTS (15 pins), 2_POWER (6 pins)
GND: 3_MCU (17 pins), 4_DIGITAL (5 pins), 5_OUTPUTS (20 pins), 2_POWER (13 pins)
A0_ACCEL: 3_MCU (U3.40), 4_DIGITAL (TP27.1 U4.15)
A0_GYRO: 3_MCU (U3.39), 4_DIGITAL (TP28.1 U4.10)
ADC1: 3_MCU (TP7.1 U3.14), 5_OUTPUTS (P6.2)
ADC2: 3_MCU (TP8.1 U3.15), 5_OUTPUTS (P7.2)
GPIO1: 3_MCU (TP29.1 U3.30), 5_OUTPUTS (R?#5.1 R?#6.2 R?#15.1 R?#16.2)
GPIO2: 3_MCU (TP30.1 U3.29), 5_OUTPUTS (R?#7.1 R?#8.2)
GPIO4: 3_MCU (TP19.1 U3.27), 5_OUTPUTS (R?#19.1 R?#20.2)
GPIO5: 3_MCU (TP20.1 U3.26), 5_OUTPUTS (R?#13.1 R?#14.2)
GPIO6: 3_MCU (TP11.1 U3.25), 5_OUTPUTS (U8.15)
GPIO7: 3_MCU (TP12.1 U3.24), 5_OUTPUTS (U8.13)
GPIO8: 3_MCU (TP10.1 U3.23), 5_OUTPUTS (U8.11)
GPIO9: 3_MCU (TP9.1 U3.22), 5_OUTPUTS (U8.9)
I2C_SCL: 3_MCU (U3.41), 4_DIGITAL (R14.1 TP21.1 U4.8)
I2C_SDA: 3_MCU (U3.43), 4_DIGITAL (R13.1 TP23.1 U4.9)
INT1_ACCEL: 3_MCU (U3.38), 4_DIGITAL (TP22.1 U4.16)
INT1_GYRO: 3_MCU (U3.36), 4_DIGITAL (TP25.1 U4.12)
INT2_ACCEL: 3_MCU (U3.37), 4_DIGITAL (TP24.1 U4.1)
INT2_GYRO: 3_MCU (U3.35), 4_DIGITAL (TP26.1 U4.13)